# Altium schematic sheet SIDE.SchDoc
size A4; DrawnBy: SURAJ; SheetNumber: 6
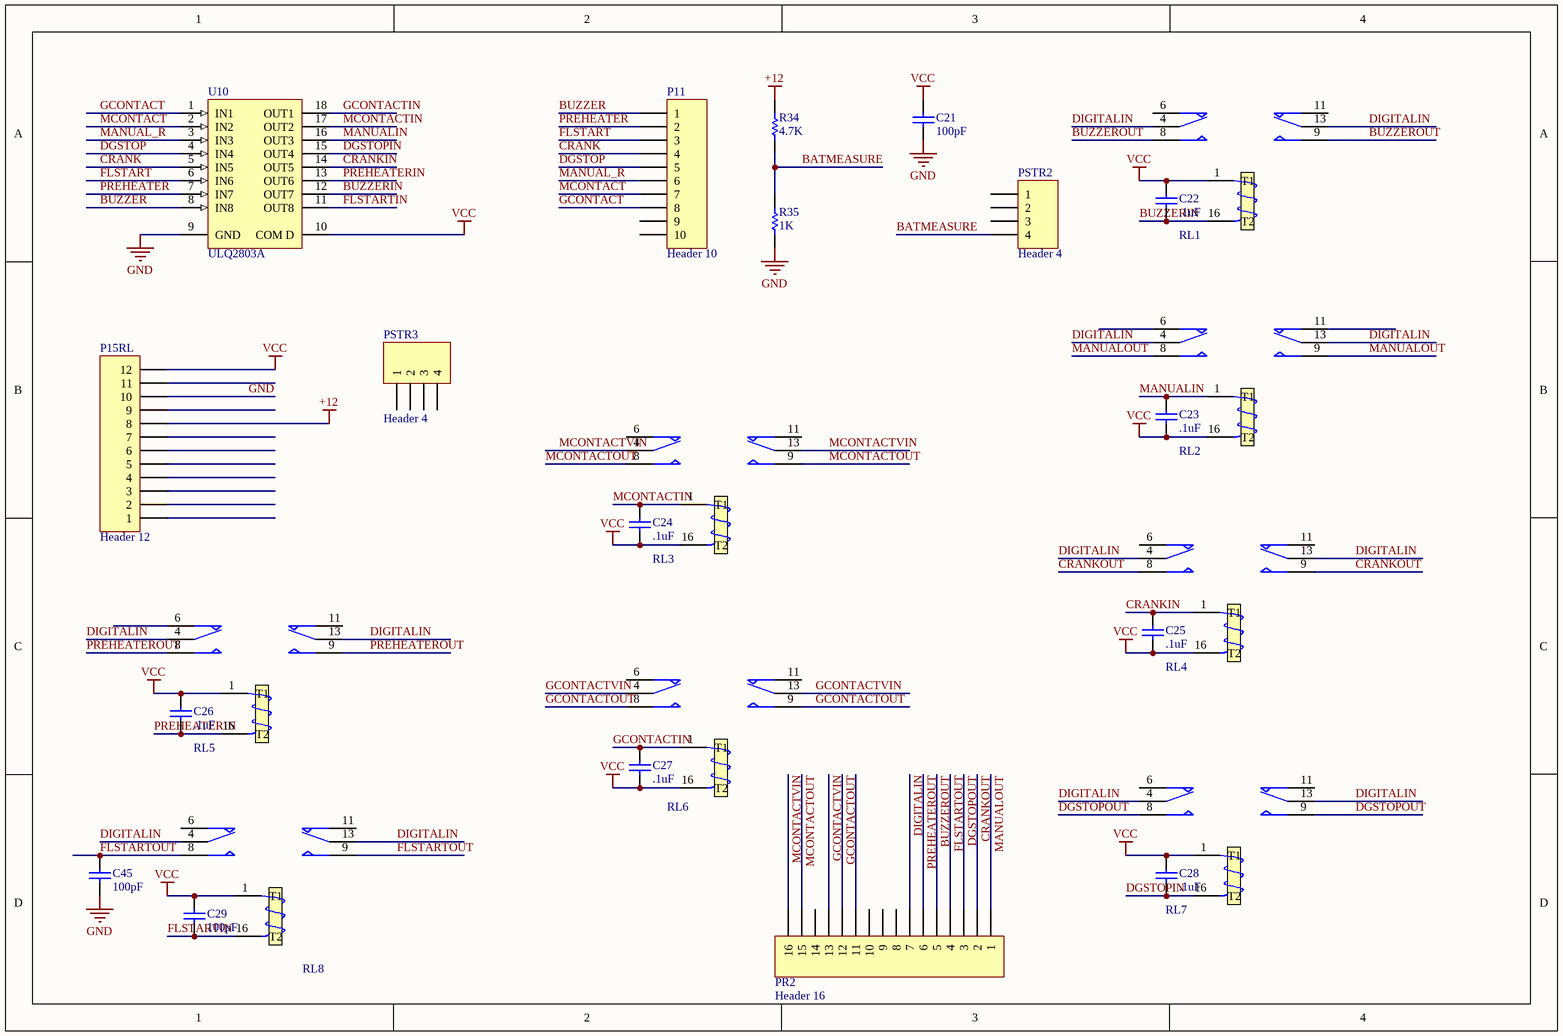
[diagram p0: SIDE.SchDoc]

## Parts
C21  value 100pF  [RAD-0.2]  (hidden comment: Cap Ceramic .1uF)
C22  value .1uF  [RAD-0.2]  (hidden comment: CAP)
C23  value .1uF  [RAD-0.2]  (hidden comment: CAP)
C24  value .1uF  [RAD-0.2]  (hidden comment: CAP)
C25  value .1uF  [RAD-0.2]  (hidden comment: CAP)
C26  value .1uF  [RAD-0.2]  (hidden comment: CAP)
C27  value .1uF  [RAD-0.2]  (hidden comment: CAP)
C28  value .1uF  [RAD-0.2]  (hidden comment: CAP)
C29  value 100pF  [RAD-0.2]  (hidden comment: CAP)
C45  value 100pF  [RAD-0.2]  (hidden comment: CAP)
P11  Header 10  [HDR1X10]
P15RL  Header 12  [HDR1X12]
PR2  Header 16  [HDR1X16]
PSTR2  Header 4  [HDR1X4]
PSTR3  Header 4  [HDR1X4]
R34  value 4.7K  [AXIAL-0.4]  (hidden comment: Res 4.7K)
R35  value 1K  [AXIAL-0.4]  (hidden comment: Res 1K)
RL1  DPDT RELAY  [RELAYDPDT]  (value not drawn)
RL2  DPDT RELAY  [RELAYDPDT]  (value not drawn)
RL3  DPDT RELAY  [RELAYDPDT]  (value not drawn)
RL4  DPDT RELAY  [RELAYDPDT]  (value not drawn)
RL5  DPDT RELAY  [RELAYDPDT]  (value not drawn)
RL6  DPDT RELAY  [RELAYDPDT]  (value not drawn)
RL7  DPDT RELAY  [RELAYDPDT]  (value not drawn)
RL8  DPDT RELAY  [RELAYDPDT]  (value not drawn)
U10  ULQ2803A  [DIP18]

## Nets
+12: P15RL.8 R34.2
GND: C21.1 C45.1 P15RL.10 R35.1 U10.9(GND)
VCC: C21.2 C22.2 C23.1 C24.1 C25.1 C26.2 C27.1 C28.2 C29.2 P15RL.12 RL1.1(T1) RL2.16(T2) RL3.16(T2) RL4.16(T2) RL5.1(T1) RL6.16(T2) RL7.1(T1) RL8.1(T1) U10.10(COM_D)
BATMEASURE: PSTR2.4 R34.1 R35.2
BUZZER: P11.1 U10.8(IN8)
BUZZERIN: C22.1 RL1.16(T2) U10.12(OUT7)
BUZZEROUT: PR2.5 RL1.8(NO) RL1.9(NO)
CRANK: P11.4 U10.5(IN5)
CRANKIN: C25.2 RL4.1(T1) U10.14(OUT5)
CRANKOUT: PR2.2 RL4.8(NO) RL4.9(NO)
DGSTOP: P11.5 U10.4(IN4)
DGSTOPIN: C28.1 RL7.16(T2) U10.15(OUT4)
DGSTOPOUT: PR2.3 RL7.8(NO) RL7.9(NO)
DIGITALIN: PR2.7 RL1.4(COM) RL1.13(COM) RL2.4(COM) RL2.13(COM) RL4.4(COM) RL4.13(COM) RL5.4(COM) RL5.13(COM) RL7.4(COM) RL7.13(COM) RL8.4(COM) RL8.13(COM)
FLSTART: P11.3 U10.6(IN6)
FLSTARTIN: C29.1 RL8.16(T2) U10.11(OUT8)
FLSTARTOUT: C45.2 PR2.4 RL8.8(NO) RL8.9(NO)
GCONTACT: P11.8 U10.1(IN1)
GCONTACTIN: C27.2 RL6.1(T1) U10.18(OUT1)
GCONTACTOUT: PR2.12 RL6.8(NO) RL6.9(NO)
GCONTACTVIN: PR2.13 RL6.4(COM) RL6.13(COM)
MANUAL_R: P11.6 U10.3(IN3)
MANUALIN: C23.2 RL2.1(T1) U10.16(OUT3)
MANUALOUT: PR2.1 RL2.8(NO) RL2.9(NO)
MCONTACT: P11.7 U10.2(IN2)
MCONTACTIN: C24.2 RL3.1(T1) U10.17(OUT2)
MCONTACTOUT: PR2.15 RL3.8(NO) RL3.9(NO)
MCONTACTVIN: PR2.16 RL3.4(COM) RL3.13(COM)
PREHEATER: P11.2 U10.7(IN7)
PREHEATERIN: C26.1 RL5.16(T2) U10.13(OUT6)
PREHEATEROUT: PR2.6 RL5.8(NO) RL5.9(NO)

Not connected (* = marked no-connect by the designer): P11 9 10; P15RL 1 2 3 4 5 6 7 9 11; PR2 8 9 10 11 14; PSTR2 1 2 3; PSTR3 1 2 3 4; RL1 6(NC) 11(NC); RL2 6(NC) 11(NC); RL3 6(NC) 11(NC); RL4 6(NC) 11(NC); RL5 6(NC) 11(NC); RL6 6(NC) 11(NC); RL7 6(NC) 11(NC); RL8 6(NC) 11(NC)

## Library data of the parts
C21 = Cap: Capacitor; Published: 8-Jun-2000; LatestRevisionDate: 17-Jul-2002; LatestRevisionNote: Re-released for DXP Platform.; PackageReference: RAD-0.3; Publisher: Altium Limited; PackageDescription: Radial Cap, Thru-Hole; 2 Leads; 0.3 in Pin Spacing
C22-C29 C45 = CAP: Capacitor; Published: 8-Jun-2000; LatestRevisionDate: 17-Jul-2002; LatestRevisionNote: Re-released for DXP Platform.; PackageReference: RAD-0.3; Publisher: Altium Limited; PackageDescription: Radial Cap, Thru-Hole; 2 Leads; 0.3 in Pin Spacing
P11 = Header 10: Header, 10-Pin; LatestRevisionDate: 17-Jul-2002; LatestRevisionNote: Re-released for DXP Platform.; Publisher: Altium Limited
P15RL = Header 12: Header, 12-Pin; LatestRevisionDate: 17-Jul-2002; LatestRevisionNote: Re-released for DXP Platform.; Publisher: Altium Limited
PR2 = Header 16: Header, 16-Pin; LatestRevisionDate: 17-Jul-2002; LatestRevisionNote: Re-released for DXP Platform.; Publisher: Altium Limited
PSTR2 PSTR3 = Header 4: Header, 4-Pin; LatestRevisionDate: 17-Jul-2002; LatestRevisionNote: Re-released for DXP Platform.; Publisher: Altium Limited
R34 R35 = Res1: Resistor; Published: 8-Jun-2000; LatestRevisionDate: 17-Jul-2002; LatestRevisionNote: Re-released for DXP Platform.; PackageReference: AXIAL-0.3; Publisher: Altium Limited; PackageDescription: Axial Device, Thru-Hole; 2 Leads; 0.3 in Pin Spacing
RL1-RL8 = RELAYDPDT
U10 = ULQ2803A: Eight Darlington Array; Published: 8-Jun-2000; LatestRevisionDate: 06-Jun-2005; LatestRevisionNote: Stylized 3D Model Added.; DatasheetVersion: Apr-1993; PackageReference: DIP18; Publisher: Altium Limited; PackageDescription: DIP; 18 Leads; Row Spacing 7.62 mm; Pitch 2.54 mm; ComponentLink1Description: Manufacturer Link; ComponentLink1URL: http://www.st.com/; ComponentLink2Description: Datasheet; ComponentLink2URL: http://www.st.com/stonline/products/literature/ds/1538/ulq2801.pdf